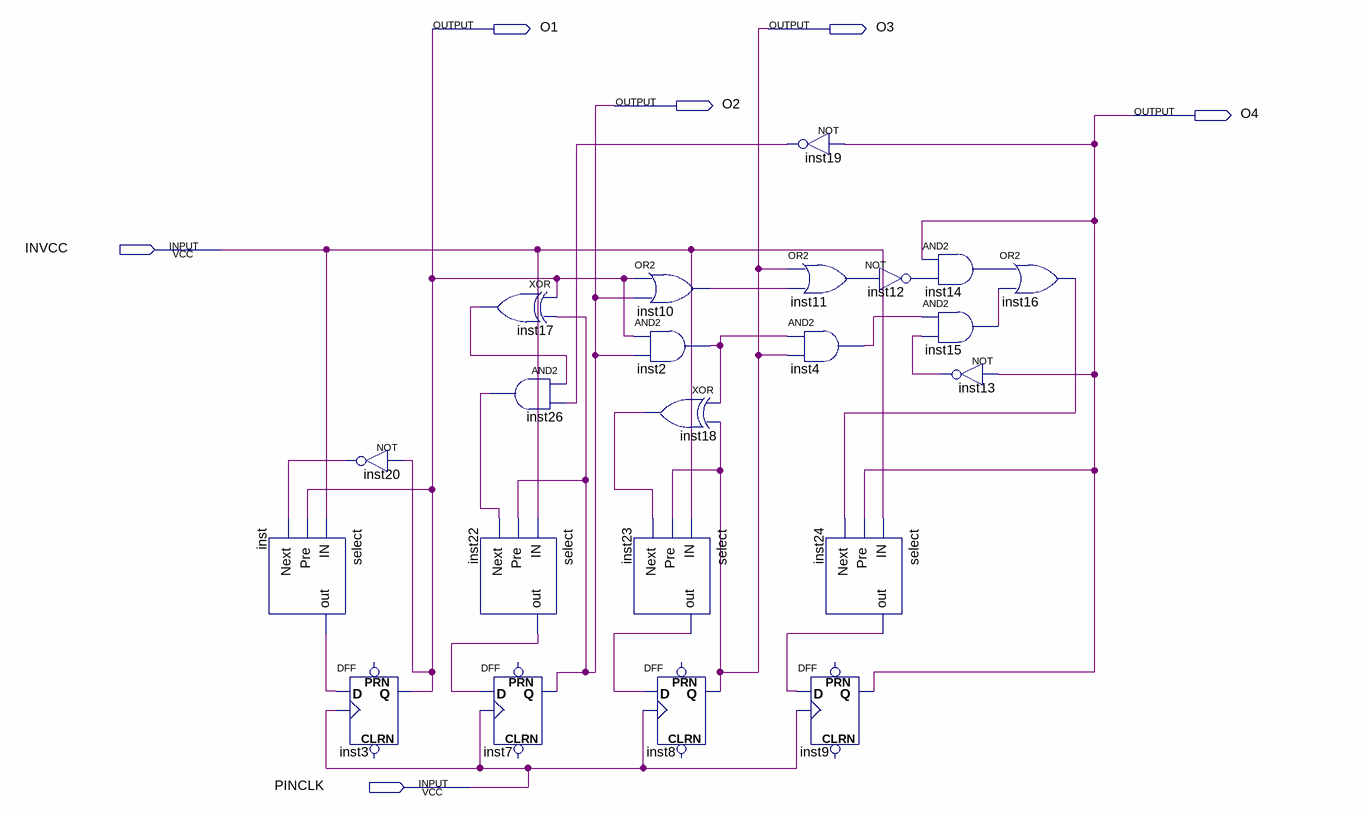
[diagram p0: schematic sheet]
// Quartus schematic Count127.bdf as structural Verilog: 22 symbols, 6 pins
module Count127 (
  input  INVCC,
  input  PINCLK,
  output O1,
  output O3,
  output O2,
  output O4
);

  wire inst2_out, inst4_out, inst10_out, inst11_out, inst12_out, inst13_out, inst14_out, inst15_out,
       inst16_out, inst17_out, inst18_out, inst19_out, inst20_out, inst22_out, inst23_out, inst24_out,
       inst26_out, inst_out;

  select inst (.IN(INVCC), .Pre(O1), .Next(inst20_out), .out(inst_out));
  not inst20 (inst20_out, O1);
  DFF inst3 (.CLK(PINCLK), .D(inst_out), .Q(O1));  // open: CLRN, PRN
  xor inst17 (inst17_out, O1, O2);
  and inst26 (inst26_out, inst17_out, inst19_out);
  select inst22 (.IN(INVCC), .Pre(O2), .Next(inst26_out), .out(inst22_out));
  DFF inst7 (.CLK(PINCLK), .D(inst22_out), .Q(O2));  // open: CLRN, PRN
  or inst10 (inst10_out, O1, O2);
  and inst2 (inst2_out, O1, O2);
  xor inst18 (inst18_out, inst2_out, O3);
  select inst23 (.IN(INVCC), .Pre(O3), .Next(inst18_out), .out(inst23_out));
  DFF inst8 (.CLK(PINCLK), .D(inst23_out), .Q(O3));  // open: CLRN, PRN
  not inst19 (inst19_out, O4);
  or inst11 (inst11_out, O3, inst10_out);
  and inst4 (inst4_out, inst2_out, O3);
  select inst24 (.IN(INVCC), .Pre(O4), .Next(inst16_out), .out(inst24_out));
  DFF inst9 (.CLK(PINCLK), .D(inst24_out), .Q(O4));  // open: CLRN, PRN
  not inst12 (inst12_out, inst11_out);
  and inst14 (inst14_out, O4, inst12_out);
  and inst15 (inst15_out, inst4_out, inst13_out);
  not inst13 (inst13_out, O4);
  or inst16 (inst16_out, inst14_out, inst15_out);
endmodule
